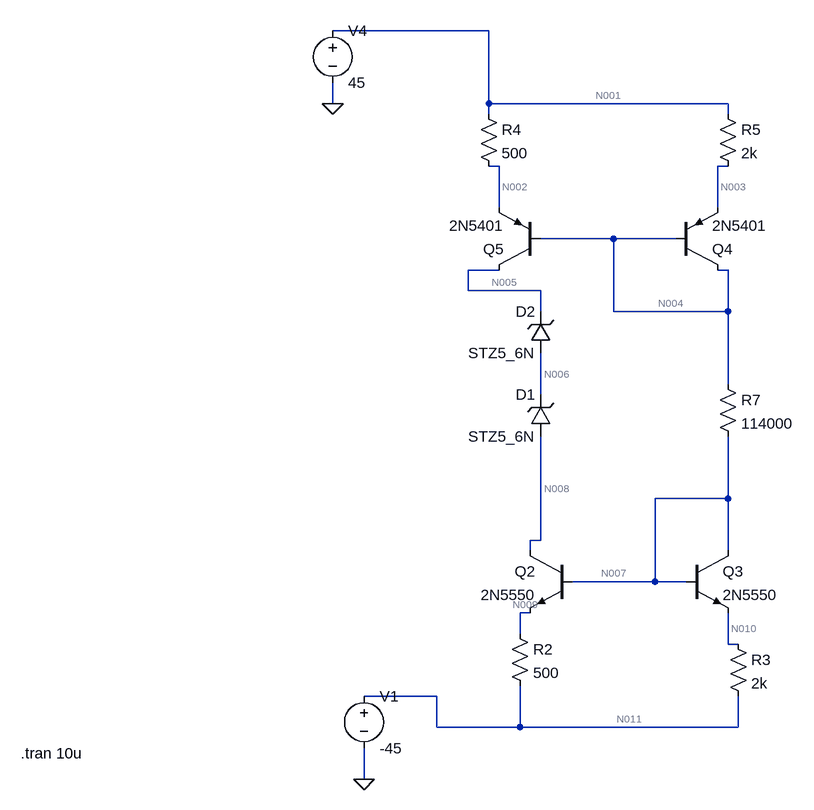
[diagram p0: schematic CurrentMirror.asc]
CurrentMirror.asc, the LTspice schematic file:
Version 4
SHEET 1 1192 756
WIRE 416 -416 176 -416
WIRE 176 -304 176 -336
WIRE 416 -304 416 -416
WIRE 784 -304 416 -304
WIRE 416 -288 416 -304
WIRE 784 -288 784 -304
WIRE 432 -208 416 -208
WIRE 784 -208 768 -208
WIRE 432 -144 432 -208
WIRE 768 -144 768 -208
WIRE 608 -96 496 -96
WIRE 704 -96 608 -96
WIRE 432 -48 384 -48
WIRE 784 -48 768 -48
WIRE 384 -16 384 -48
WIRE 496 -16 384 -16
WIRE 496 16 496 -16
WIRE 608 16 608 -96
WIRE 784 16 784 -48
WIRE 784 16 608 16
WIRE 784 128 784 16
WIRE 496 144 496 80
WIRE 784 304 784 208
WIRE 784 304 672 304
WIRE 496 368 496 208
WIRE 496 368 480 368
WIRE 480 384 480 368
WIRE 784 384 784 304
WIRE 672 432 672 304
WIRE 672 432 544 432
WIRE 720 432 672 432
WIRE 480 480 464 480
WIRE 464 512 464 480
WIRE 784 528 784 480
WIRE 800 528 784 528
WIRE 336 608 224 608
WIRE 336 656 336 608
WIRE 464 656 464 592
WIRE 464 656 336 656
WIRE 800 656 800 608
WIRE 800 656 464 656
WIRE 224 736 224 688
FLAG 176 -304 0
FLAG 224 736 0
DATAFLAG 336 -416 ""
DATAFLAG 416 656 ""
DATAFLAG 784 496 ""
DATAFLAG 464 480 ""
DATAFLAG 768 -176 ""
DATAFLAG 432 -192 ""
SYMBOL voltage 176 -432 R0
WINDOW 123 0 0 Left 0
WINDOW 39 0 0 Left 0
SYMATTR InstName V4
SYMATTR Value 45
SYMBOL npn 544 384 M0
SYMATTR InstName Q2
SYMATTR Value 2N5550
SYMBOL npn 720 384 R0
SYMATTR InstName Q3
SYMATTR Value 2N5550
SYMBOL pnp 704 -48 M180
SYMATTR InstName Q4
SYMATTR Value 2N5401
SYMBOL pnp 496 -48 R180
SYMATTR InstName Q5
SYMATTR Value 2N5401
SYMBOL res 448 496 R0
SYMATTR InstName R2
SYMATTR Value 500
SYMBOL res 784 512 R0
SYMATTR InstName R3
SYMATTR Value 2k
SYMBOL res 400 -304 R0
SYMATTR InstName R4
SYMATTR Value 500
SYMBOL res 768 -304 R0
SYMATTR InstName R5
SYMATTR Value 2k
SYMBOL zener 512 208 R180
WINDOW 0 24 64 Left 2
WINDOW 3 24 0 Left 2
SYMATTR InstName D1
SYMATTR Value STZ5_6N
SYMATTR Description Diode
SYMATTR Type diode
SYMBOL zener 512 80 R180
WINDOW 0 24 64 Left 2
WINDOW 3 24 0 Left 2
SYMATTR InstName D2
SYMATTR Value STZ5_6N
SYMATTR Description Diode
SYMATTR Type diode
SYMBOL res 768 112 R0
SYMATTR InstName R7
SYMATTR Value 114000
SYMBOL voltage 224 592 R0
WINDOW 123 0 0 Left 0
WINDOW 39 0 0 Left 0
SYMATTR InstName V1
SYMATTR Value -45
TEXT -304 696 Left 2 !.tran 10u

The netlist it stands for:
* CurrentMirror.asc
V4 N001 0 45
Q2 N008 N007 N009 0 2N5550
Q3 N007 N007 N010 0 2N5550
Q4 N004 N004 N003 0 2N5401
Q5 N005 N004 N002 0 2N5401
R2 N009 N011 500
R3 N010 N011 2k
R4 N001 N002 500
R5 N001 N003 2k
D1 N008 N006 STZ5_6N
D2 N006 N005 STZ5_6N
R7 N004 N007 114000
V1 N011 0 -45
.model D D
.lib standard.dio
.model NPN NPN
.model PNP PNP
.lib standard.bjt
.tran 10u
.backanno
.end

* Results of the author's LTspice run, read from the files saved beside the schematic
* Operating Point, zero values left out:
*   V(n001) = 45 V
*   V(n008) = -1.009 V
*   V(n007) = -42.85 V
*   V(n009) = -43.56 V
*   V(n010) = -43.53 V
*   V(n004) = 42.91 V
*   V(n003) = 43.53 V
*   V(n005) = 10.2 V
*   V(n002) = 43.56 V
*   V(n011) = -45 V
*   V(n006) = 4.597 V
*   Ic(Q5) = -2.859 mA
*   Ib(Q5) = -18.67 µA
*   Ie(Q5) = 2.878 mA
*   Ic(Q4) = -727.1 µA
*   Ib(Q4) = -6.506 µA
*   Ie(Q4) = 733.6 µA
*   Ic(Q3) = 725.2 µA
*   Ib(Q3) = 7.726 µA
*   Ie(Q3) = -732.9 µA
*   Ic(Q2) = 2.859 mA
*   Ib(Q2) = 19.37 µA
*   Ie(Q2) = -2.878 mA
*   I(D2) = -2.859 mA
*   I(D1) = -2.859 mA
*   I(R7) = 752.3 µA
*   I(R5) = 733.6 µA
*   I(R4) = 2.878 mA
*   I(R3) = 732.9 µA
*   I(R2) = 2.878 mA
*   I(V1) = 3.611 mA
*   I(V4) = -3.611 mA